# EasyEDA Pro project ProPrj_piezoAmpBoard_2024-09-30.epro

# Schematic Schematic1
Board Name: Board1; Create Date: 2024-03-08; Page Name: P1; Project Name: piezoAmpBoard; Schematic Name: Schematic1; Update Date: 2024-03-09; Company: 嘉立创EDA; Page Size: A4; Version: V1.0
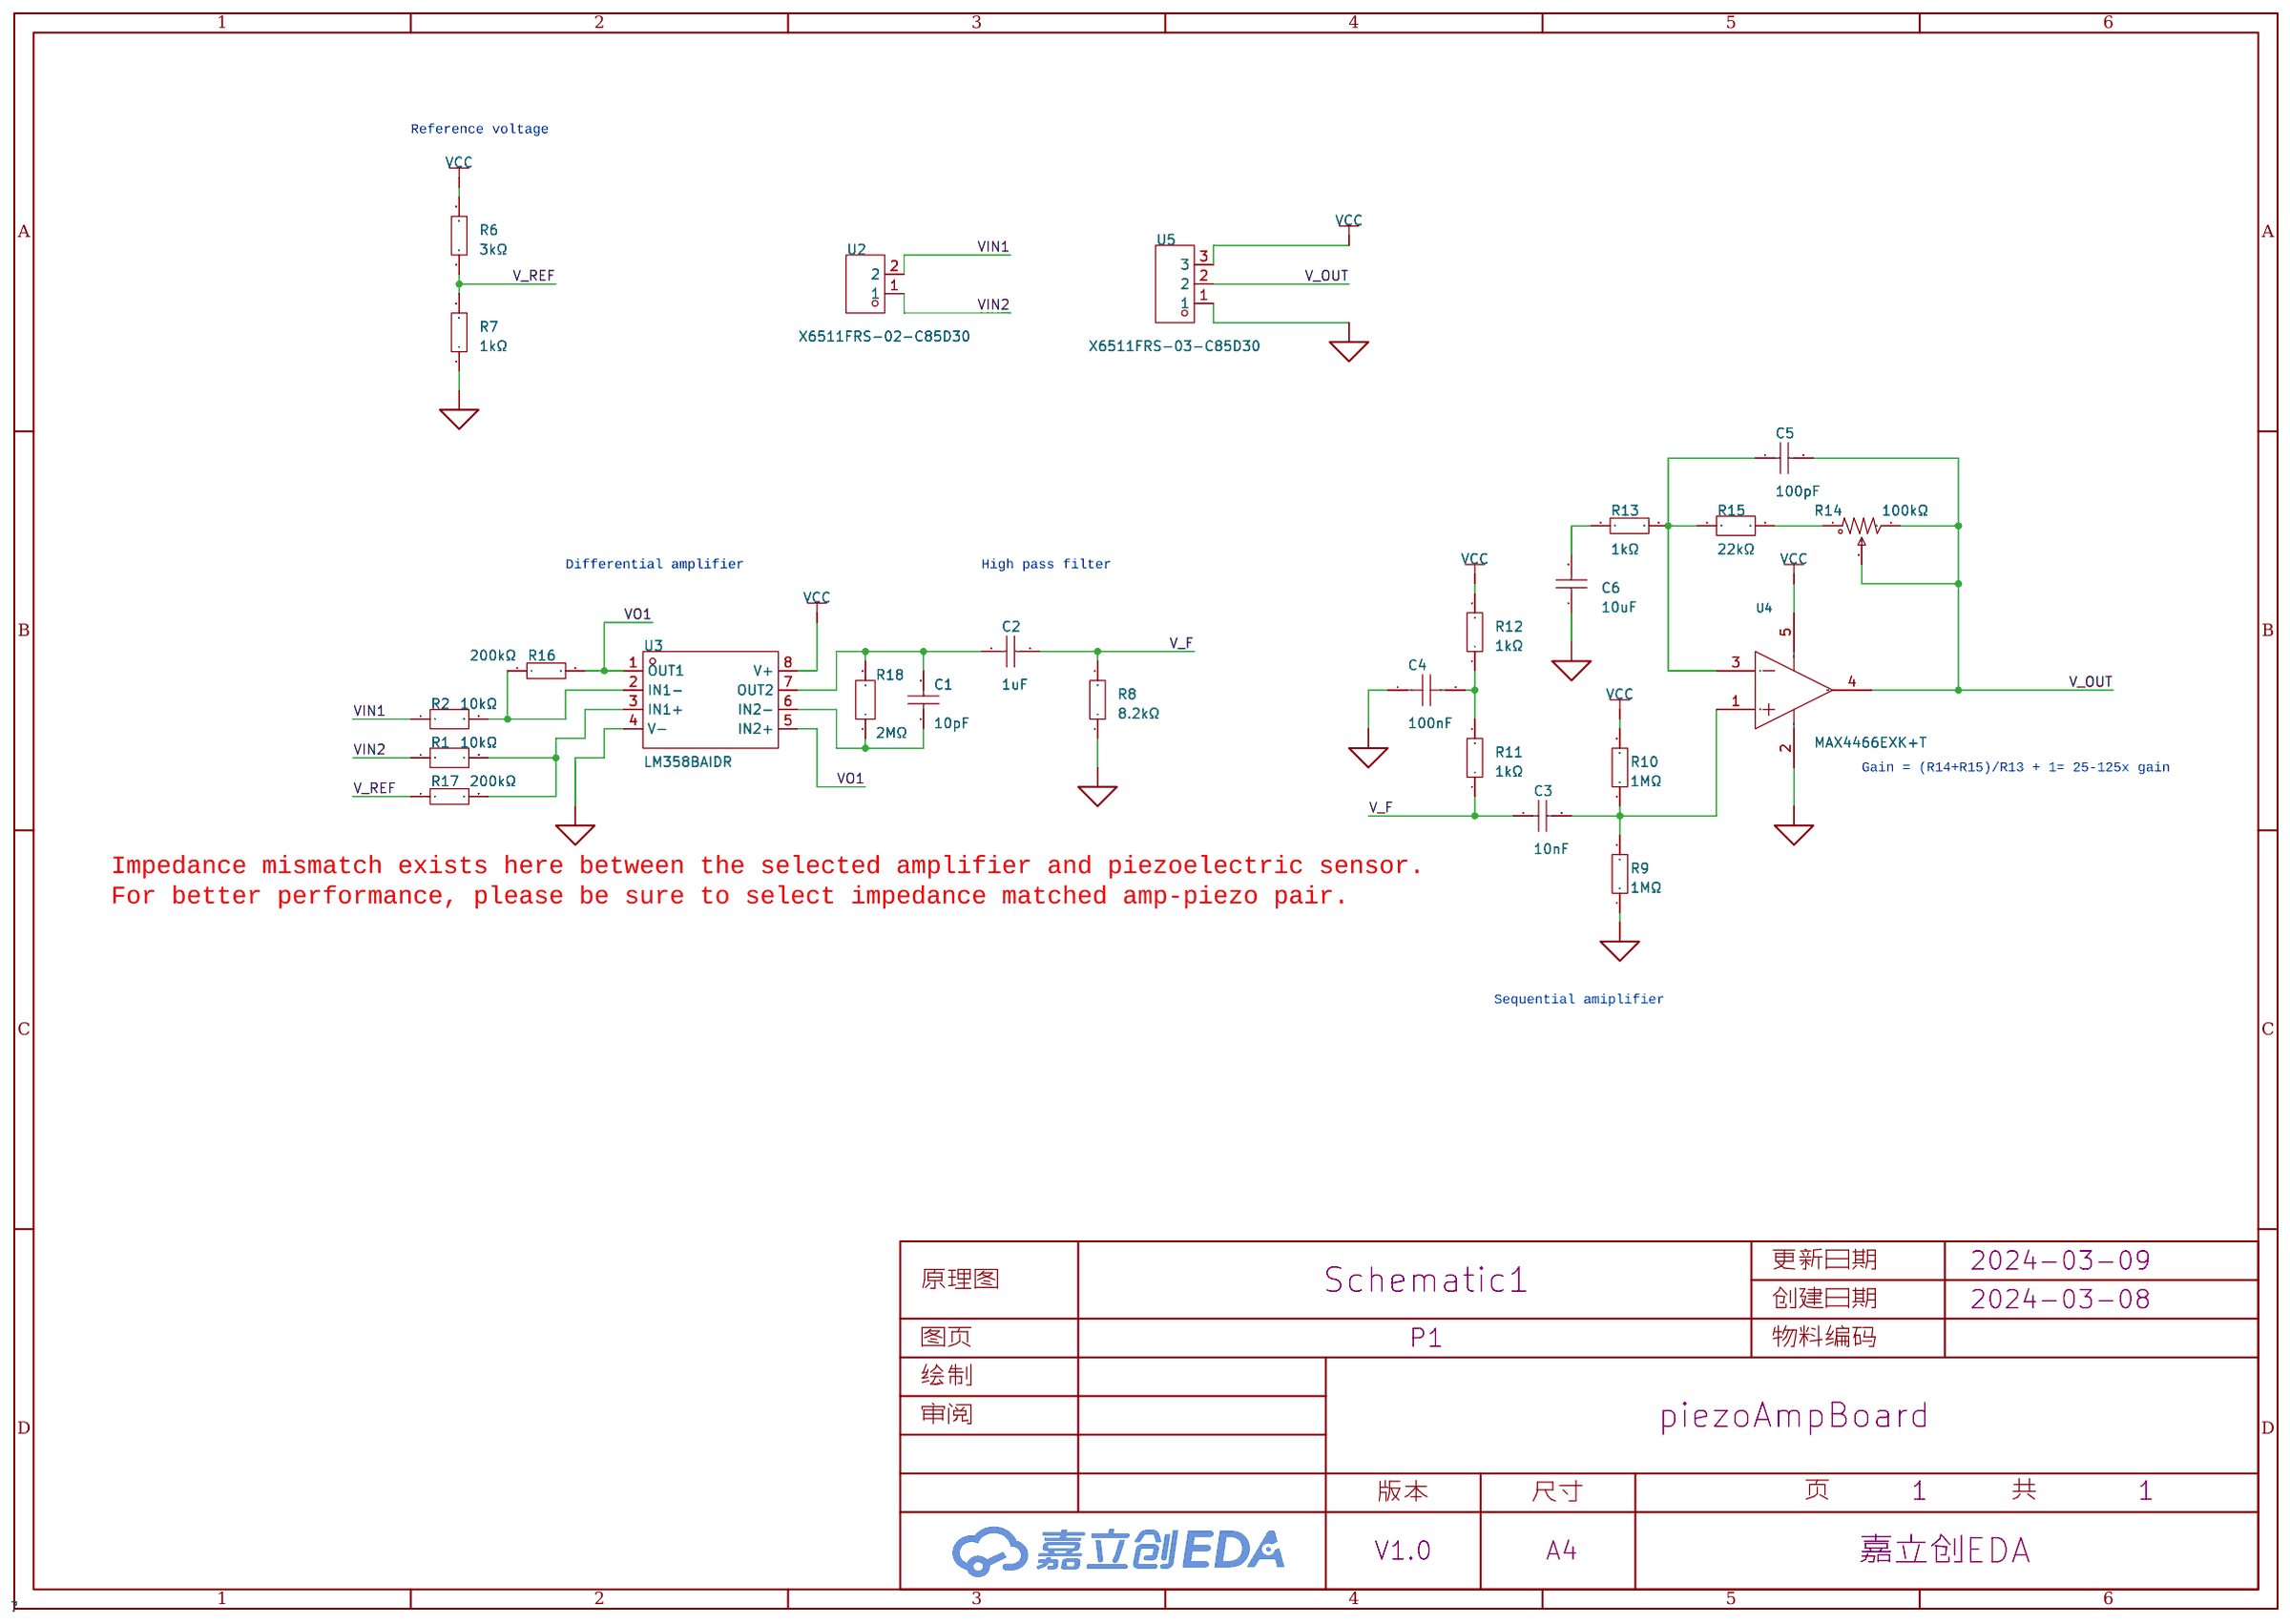
[diagram p0: schematic sheet]

## Parts
C1  10pF  [C0402]
C2  1uF  [C0402]
C3  10nF  [C0402]
C4  100nF  [C0402]
C5  100pF  [C0402]
C6  10uF  [C0402]
R1  10kΩ  [R0201]
R2  10kΩ  [R0201]
R6  3kΩ  [R0402]
R7  1kΩ  [R0402]
R8  8.2kΩ  [R0402]
R9  1MΩ  [R0201]
R10  1MΩ  [R0201]
R11  1kΩ  [R0201]
R12  1kΩ  [R0201]
R13  1kΩ  [R0201]
R14  100kΩ  [RES-ADJ-SMD_TC33X-2-104E]
R15  22kΩ  [R0201]
R16  200kΩ  [R0201]
R17  200kΩ  [R0201]
R18  2MΩ  [R0201]
U2  X6511FRS-02-C85D30  [HDR-SMD_2P-P2.54-H-F-L11.5]
U3  LM358BAIDR  [SOIC-8_L4.9-W3.9-P1.27-LS6.0-BL]
U4  MAX4466EXK+T  [SC-70-5_L2.0-W1.3-P0.65-LS2.1-BR]
U5  X6511FRS-03-C85D30  [HDR-SMD_3P-P2.54-H-F-L11.5]

## Library data of the parts
C1 = CC0402JRNPO9BN100: 容值:10pF;精度:±5%;额定电压:50V;材质(温度系数):NP0;; LCSC Part Name: 10pF ±5% 50V; Supplier Part: C106199; Manufacturer: YAGEO(国巨); Supplier Footprint: 0402; JLCPCB Part Class: 扩展库; Datasheet: https://atta.szlcsc.com/upload/public/pdf/source/20181008/C309499_21CC21451B82C39E3D92150FD6B30293.pdf; Supplier: LCSC; Tolerance: ±5%; Voltage Rated: 50V; Temperature Coefficient: NP0
C2 = CL05A105KP5NNNC: 容值:1uF;精度:±10%;额定电压:10V;材质(温度系数):X5R;; LCSC Part Name: 1uF ±10% 10V; Supplier Part: C14445; Manufacturer: SAMSUNG(三星); Supplier Footprint: 0402; JLCPCB Part Class: 扩展库; Datasheet: https://atta.szlcsc.com/upload/public/pdf/source/20160218/1457707763339.pdf; Supplier: LCSC; Tolerance: ±10%; Voltage Rated: 10V; Temperature Coefficient: X5R
C3 = CC0402KRX7R9BB103: 容值:10nF;精度:±10%;额定电压:50V;材质(温度系数):X7R;; LCSC Part Name: 10nF ±10% 50V; Supplier Part: C60133; Manufacturer: YAGEO(国巨); Supplier Footprint: 0402; JLCPCB Part Class: 扩展库; Datasheet: https://atta.szlcsc.com/upload/public/pdf/source/20180224/C181747_15194369449651363981.pdf; Supplier: LCSC; Tolerance: ±10%; Voltage Rated: 50V; Temperature Coefficient: X7R
C4 = CC0402KRX7R7BB104: 容值:100nF;精度:±10%;额定电压:16V;材质(温度系数):X7R;; LCSC Part Name: 100nF ±10% 16V; Supplier Part: C60474; Manufacturer: YAGEO(国巨); Supplier Footprint: 0402; JLCPCB Part Class: 扩展库; Datasheet: https://atta.szlcsc.com/upload/public/pdf/source/20211223/9278FD768280B81DDBEF48FA36411A03.pdf; Supplier: LCSC; Tolerance: ±10%; Voltage Rated: 16V; Temperature Coefficient: X7R
C5 = GRM1555C1H101JA01D: 容值:100pF;精度:±5%;额定电压:50V;材质(温度系数):C0G;; LCSC Part Name: 100pF ±5% 50V; Supplier Part: C77177; Manufacturer: muRata(村田); Supplier Footprint: 0402; JLCPCB Part Class: 扩展库; Datasheet: https://atta.szlcsc.com/upload/public/pdf/source/20161108/1478586482814.pdf; Supplier: LCSC; Tolerance: ±5%; Voltage Rated: 50V; Temperature Coefficient: C0G
C6 = GRM155R60J106ME44D: 容值:10uF;精度:±20%;额定电压:6.3V;材质(温度系数):X5R;; LCSC Part Name: 10uF ±20% 6.3V; Supplier Part: C76991; Manufacturer: muRata(村田); Supplier Footprint: 0402; JLCPCB Part Class: 扩展库; Datasheet: https://atta.szlcsc.com/upload/public/pdf/source/20200305/C490387_23319AE8C154DEB24C505E6C82A8106A.pdf; Supplier: LCSC; Tolerance: ±20%; Voltage Rated: 6.3V; Temperature Coefficient: X5R
R1 R2 = 0201WMF1002TEE: 电阻类型:厚膜电阻;阻值:10kΩ;精度:±1%;功率:50mW;最大工作电压:25V;温度系数:±200ppm/℃;; LCSC Part Name: 10kΩ ±1% 50mW 厚膜电阻; Supplier Part: C473048; Manufacturer: UNI-ROYAL(厚声); Supplier Footprint: 0201; JLCPCB Part Class: 扩展库; Datasheet: https://atta.szlcsc.com/upload/public/pdf/source/20200306/C422600_1E6D84923E4A46A82E41ADD87F860B5C.pdf; Supplier: LCSC; Type: 厚膜电阻; Tolerance: ±1%; Power(Watts): 50mW; Overload Voltage (Max): 25V; Temperature Coefficient: ±200ppm/℃; Operating Temperature Range: -55℃~+155℃
R6 = 0402WGF3001TCE: 电阻类型:厚膜电阻;阻值:3kΩ;精度:±1%;功率:62.5mW;最大工作电压:50V;温度系数:±100ppm/℃;; LCSC Part Name: 3kΩ ±1% 62.5mW 厚膜电阻; Supplier Part: C25784; Manufacturer: UNI-ROYAL(厚声); Supplier Footprint: 0402; JLCPCB Part Class: 扩展库; Datasheet: https://atta.szlcsc.com/upload/public/pdf/source/20200306/C422600_1E6D84923E4A46A82E41ADD87F860B5C.pdf; Supplier: LCSC; Type: 厚膜电阻; Tolerance: ±1%; Power(Watts): 62.5mW; Overload Voltage (Max): 50V; Temperature Coefficient: ±100ppm/℃; Operating Temperature Range: -55℃~+155℃
R7 = 0402WGF1001TCE: 电阻类型:厚膜电阻;阻值:1kΩ;精度:±1%;功率:62.5mW;最大工作电压:50V;温度系数:±100ppm/℃;; LCSC Part Name: 1kΩ ±1% 62.5mW 厚膜电阻; Supplier Part: C11702; Manufacturer: UNI-ROYAL(厚声); Supplier Footprint: 0402; JLCPCB Part Class: 基础库; Datasheet: https://atta.szlcsc.com/upload/public/pdf/source/20200306/C422600_1E6D84923E4A46A82E41ADD87F860B5C.pdf; Supplier: LCSC; Type: 厚膜电阻; Tolerance: ±1%; Power(Watts): 62.5mW; Overload Voltage (Max): 50V; Temperature Coefficient: ±100ppm/℃; Operating Temperature Range: -55℃~+155℃
R8 = 0402WGF8201TCE: 电阻类型:厚膜电阻;阻值:8.2kΩ;精度:±1%;功率:62.5mW;最大工作电压:50V;温度系数:±100ppm/℃;; LCSC Part Name: 8.2kΩ ±1% 62.5mW 厚膜电阻; Supplier Part: C25924; Manufacturer: UNI-ROYAL(厚声); Supplier Footprint: 0402; JLCPCB Part Class: 扩展库; Datasheet: https://atta.szlcsc.com/upload/public/pdf/source/20200306/C422600_1E6D84923E4A46A82E41ADD87F860B5C.pdf; Supplier: LCSC; Type: 厚膜电阻; Tolerance: ±1%; Power(Watts): 62.5mW; Overload Voltage (Max): 50V; Temperature Coefficient: ±100ppm/℃; Operating Temperature Range: -55℃~+155℃
R9 R10 = RC0201FR-071ML: 电阻类型:厚膜电阻;阻值:1MΩ;精度:±1%;功率:50mW;最大工作电压:25V;温度系数:±200ppm/℃;; LCSC Part Name: 厚膜电阻 1MΩ ±1% 50mW; Supplier Part: C295786; Manufacturer: YAGEO(国巨); Supplier Footprint: 0201; JLCPCB Part Class: 扩展库; Datasheet: https://atta.szlcsc.com/upload/public/pdf/source/20181009/C309620_DA5935B6E1D48212CB7A533FE518B3C2.pdf; Supplier: LCSC; Type: 厚膜电阻; Tolerance: ±1%; Power(Watts): 50mW; Overload Voltage (Max): 25V; Temperature Coefficient: ±200ppm/℃; Operating Temperature Range: -55℃~+125℃
R11-R13 = 0201WMF1001TEE: 电阻类型:厚膜电阻;阻值:1kΩ;精度:±1%;功率:50mW;最大工作电压:25V;温度系数:±200ppm/℃;; LCSC Part Name: 1kΩ ±1% 50mW 厚膜电阻; Supplier Part: C270365; Manufacturer: UNI-ROYAL(厚声); Supplier Footprint: 0201; JLCPCB Part Class: 扩展库; Datasheet: https://atta.szlcsc.com/upload/public/pdf/source/20200306/C422600_1E6D84923E4A46A82E41ADD87F860B5C.pdf; Supplier: LCSC; Type: 厚膜电阻; Tolerance: ±1%; Power(Watts): 50mW; Overload Voltage (Max): 25V; Temperature Coefficient: ±200ppm/℃; Operating Temperature Range: -55℃~+155℃
R14 = TC33X-2-104E: 阻值:100kΩ;精度:±25%;功率:150mW;温度系数:±250ppm/℃;; LCSC Part Name: 100kΩ ±25%; Supplier Part: C719186; Manufacturer: BOURNS; Supplier Footprint: SMD; JLCPCB Part Class: 扩展库; Datasheet: https://atta.szlcsc.com/upload/public/pdf/source/20200810/C720646_BB66A75E654D5E1D30127FF45BCD3C26.pdf; Supplier: LCSC; Tolerance: ±25%; Power(Watts): 150mW; Temperature Coefficient: ±250ppm/℃; Turns: 1
R15 = RC0201FR-0722KL: 电阻类型:厚膜电阻;阻值:22kΩ;精度:±1%;功率:50mW;最大工作电压:25V;温度系数:±200ppm/℃;; LCSC Part Name: 厚膜电阻 22kΩ ±1% 50mW; Supplier Part: C474416; Manufacturer: YAGEO(国巨); Supplier Footprint: 0201; JLCPCB Part Class: 扩展库; Datasheet: https://atta.szlcsc.com/upload/public/pdf/source/20181031/C326976_E9901E35333D136A19B6CE377E889A82.pdf; Supplier: LCSC; Type: 厚膜电阻; Tolerance: ±1%; Power(Watts): 50mW; Overload Voltage (Max): 25V; Temperature Coefficient: ±200ppm/℃; Operating Temperature Range: -55℃~+125℃
R16 R17 = RC0201FR-07200KL: 电阻类型:厚膜电阻;阻值:200kΩ;精度:±1%;功率:50mW;最大工作电压:25V;温度系数:±200ppm/℃;; LCSC Part Name: 厚膜电阻 200kΩ ±1% 50mW; Supplier Part: C138163; Manufacturer: YAGEO(国巨); Supplier Footprint: 0201; JLCPCB Part Class: 扩展库; Datasheet: https://atta.szlcsc.com/upload/public/pdf/source/20181009/C309620_DA5935B6E1D48212CB7A533FE518B3C2.pdf; Supplier: LCSC; Type: 厚膜电阻; Tolerance: ±1%; Power(Watts): 50mW; Overload Voltage (Max): 25V; Temperature Coefficient: ±200ppm/℃; Operating Temperature Range: -55℃~+125℃
R18 = 0201WMF2004TEE: 电阻类型:厚膜电阻;阻值:2MΩ;精度:±1%;功率:50mW;最大工作电压:25V;温度系数:±200ppm/℃;; LCSC Part Name: 2MΩ ±1% 50mW 厚膜电阻; Supplier Part: C473556; Manufacturer: UNI-ROYAL(厚声); Supplier Footprint: 0201; JLCPCB Part Class: 扩展库; Datasheet: https://atta.szlcsc.com/upload/public/pdf/source/20200306/C422600_1E6D84923E4A46A82E41ADD87F860B5C.pdf; Supplier: LCSC; Type: 厚膜电阻; Tolerance: ±1%; Power(Watts): 50mW; Overload Voltage (Max): 25V; Temperature Coefficient: ±200ppm/℃; Operating Temperature Range: -55℃~+155℃
U2 = X6511FRS-02-C85D30: 插孔结构:1x2P;间距:2.54mm;安装类型:卧贴;排数:单排;总孔位数:2P;塑高:8.5mm;; LCSC Part Name: 间距:2.54mm 1x2P 卧贴; Supplier Part: C5142235; Manufacturer: XKB Connectivity(中国星坤); Supplier Footprint: SMD,P=2.54mm,卧贴; JLCPCB Part Class: 扩展库; Datasheet: https://atta.szlcsc.com/upload/public/pdf/source/20220822/AB9A82E80C220285963E5EFA3BFD32FF.pdf; Supplier: LCSC; Holes Structure: 1x2P; Pitch: 2.54mm; Mounting Type: 卧贴; Number of Rows: 单排; Number of Holes: 2P; Insulation Height: 8.5mm
U3 = LM358BAIDR: 放大器数:双路;增益带宽积(GBP):1.2MHz;输入偏置电流(Ib):10nA;压摆率(SR):0.5V/us;带宽(-3db):-;; LCSC Part Name: 行业标准双路运算放大器; Supplier Part: C1849421; Manufacturer: TI(德州仪器); Supplier Footprint: SOIC-8; JLCPCB Part Class: 扩展库; Datasheet: https://www.ti.com/cn/lit/gpn/lm358ba; Supplier: LCSC; Number of Circuits: 双路; Gain Bandwidth Product(GBP): 1.2MHz; Current - Input Bias(Ib): 10nA; Slew Rate(SR): 0.5V/us; Output Current: 40mA; Operating Temperature: -40℃~+125℃
U4 = MAX4466EXK+T: 功放类型:-;扬声器通道数:单声道;输出功率:-;静态电流(Iq):-;; Supplier Part: C7456762; Manufacturer: ADI(亚德诺)/MAXIM(美信); Supplier Footprint: SC-70-5; JLCPCB Part Class: 扩展库; Datasheet: https://atta.szlcsc.com/upload/public/pdf/source/20230919/1C26F795883D5A758FE0EDB1A75C39BE.pdf; Supplier: LCSC; Speaker Channels: 单声道; Supply Voltage: 2.4V~5.5V; Operating Temperature: -40℃~+85℃
U5 = X6511FRS-03-C85D30: 插孔结构:1x3P;间距:2.54mm;安装类型:卧贴;排数:单排;总孔位数:3P;塑高:8.5mm;; LCSC Part Name: 间距:2.54mm 1x3P 卧贴; Supplier Part: C5142236; Manufacturer: XKB Connectivity(中国星坤); Supplier Footprint: SMD,P=2.54mm,卧贴; JLCPCB Part Class: 扩展库; Datasheet: https://atta.szlcsc.com/upload/public/pdf/source/20220822/AB9A82E80C220285963E5EFA3BFD32FF.pdf; Supplier: LCSC; Holes Structure: 1x3P; Pitch: 2.54mm; Mounting Type: 卧贴; Number of Rows: 单排; Number of Holes: 3P; Insulation Height: 8.5mm

## Nets
AGND: C4.1 C6.1 R7.1 R8.1 R9.1 U3.4(V-) U4.2(GND) U5.1
VCC: R6.2 R10.2 R12.2 U3.8(V+) U4.5(VCC) U5.3
VIN1: R2.1 U2.2
VIN2: R1.1 U2.1
V_F: C2.2 C3.1 R8.2 R11.1
V_OUT: C5.2 R14.2 R14.3 U4.4(OUT) U5.2
V_REF: R6.1 R7.2 R17.1
VO1: R16.2 U3.1(OUT1) U3.5(IN2+)
$1N688: R1.2 R17.2 U3.3(IN1+)
$1N766: R2.2 R16.1 U3.2(IN1-)
$1N988: C1.1 R18.1 U3.6(IN2-)
$1N2751: C4.2 R11.2 R12.1
$1N2818: C3.2 R9.2 R10.1 U4.1(IN+)
$1N3169: C6.2 R13.1
$1N3329: C5.1 R13.2 R15.1 U4.3(IN-)
$1N3336: R14.1 R15.2
$1N3656: C1.2 C2.1 R18.2 U3.7(OUT2)

## Notes on the sheet
- Reference voltage
- Differential amplifier
- High pass filter
- Gain = (R14+R15)/R13 + 1= 25-125x gain
- Impedance mismatch exists here between the selected amplifier and piezoelectric sensor.
  For better performance, please be sure to select impedance matched amp-piezo pair.
- Sequential amiplifier

# Board PCB1
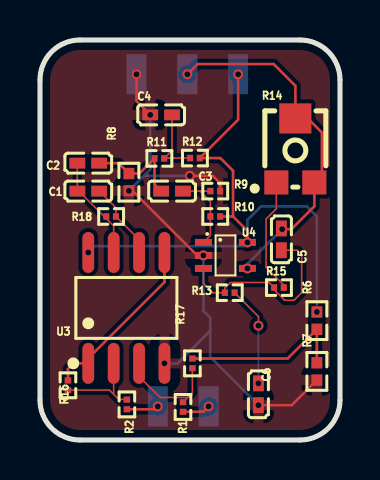
[diagram p1: board, top side]
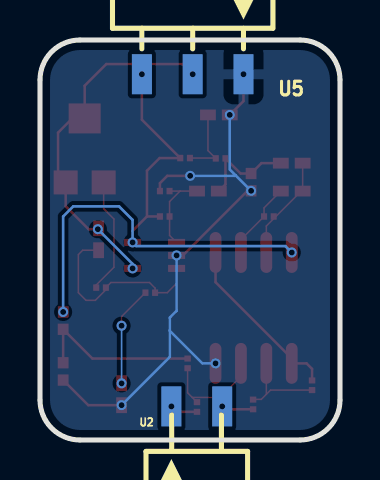
[diagram p2: board, bottom side, seen from below]

Outline 15 x 20 mm; copper layers: Top Layer, Bottom Layer. Coordinates in mm from the lower left corner of the outline.
Outline path: 0,18 0,2 arc(0.59,0.59) 2,0 13,0 arc(14.41,0.59) 15,2 15,18 arc(14.41,19.41) 13,20 2,20 arc(0.59,19.41) 0,18
Stack: Top Layer 0.035mm / Dielectric1 1.51mm FR4 er 4.5 / Bottom Layer 0.035mm

## Design rules (mm)
template: 自定义配置
spacing copperThickness1oz (default): track to track 0.102, other pairs 0.152 to 0.3
spacing copperThickness2oz: track to track 0.203, other pairs 0.152 to 0.3
track width copperThickness1oz (default): min 0.076, default 0.102, max 0.102
track width copperThickness2oz: min 0.127, default 0.152, max 0.152
differential pair differentialPair (default): width min 0.127, default 0.254, max 2.54; gap min 0.152, default 0.152
via viaSize (default): diameter min 0.5, default 0.5, max 10; hole min 0.3, default 0.3, max 6.299
net VO1 uses copperThickness2oz
net AGND uses copperThickness2oz
net VCC uses copperThickness2oz
net VIN2 uses copperThickness2oz
net VIN1 uses copperThickness2oz
net V_REF uses copperThickness2oz
net V_F uses copperThickness2oz
net V_OUT uses copperThickness2oz

## Placement (name value [footprint] x y rotation side)
C1  10pF  [C0402]  2.41 12.45 180 top
C2  1uF  [C0402]  2.41 13.84 0 top
C3  10nF  [C0402]  6.6 12.45 0 top
C4  100nF  [C0402]  6.06 16.26 0 top
C5  100pF  [C0402]  12.07 10.03 90 top
C6  10uF  [C0402]  10.92 2.29 90 top
R1  10kΩ  [R0201]  7.15 1.65 90 top
R2  10kΩ  [R0201]  4.35 1.78 90 top
R6  3kΩ  [R0402]  13.84 5.97 90 top
R7  1kΩ  [R0402]  13.84 3.43 90 top
R8  8.2kΩ  [R0402]  4.44 12.89 90 top
R9  1MΩ  [R0201]  8.76 12.45 180 top
R10  1MΩ  [R0201]  8.76 11.18 0 top
R11  1kΩ  [R0201]  5.97 14.08 0 top
R12  1kΩ  [R0201]  7.75 14.1 0 top
R13  1kΩ  [R0201]  9.49 7.37 180 top
R14  100kΩ  [RES-ADJ-SMD_TC33X-2-104E]  12.77 14.48 0 top
R15  22kΩ  [R0201]  11.95 7.62 0 top
R16  200kΩ  [R0201]  1.4 2.74 90 top
R17  200kΩ  [R0201]  7.62 3.83 270 top
R18  2MΩ  [R0201]  3.56 11.18 180 top
U2  X6511FRS-02-C85D30  [HDR-SMD_2P-P2.54-H-F-L11.5]  7.16 1.68 180 bottom
U3  LM358BAIDR  [SOIC-8_L4.9-W3.9-P1.27-LS6.0-BL]  4.32 6.6 0 top
U4  MAX4466EXK+T  [SC-70-5_L2.0-W1.3-P0.65-LS2.1-BR]  9.27 9.23 180 top
U5  X6511FRS-03-C85D30  [HDR-SMD_3P-P2.54-H-F-L11.5]  7.37 18.29 0 bottom

## Footprints (pads in the part's own frame, mm; a bottom-side part is the same pattern mirrored in y, then rotated)
C0402
  rect 0.79x0.54 smd: 1(-0.545,0) 2(0.545,0)
HDR-SMD_2P-P2.54-H-F-L11.5
  rect 1x2 smd: 1(-1.27,0) 2(1.27,0)
HDR-SMD_3P-P2.54-H-F-L11.5
  rect 1x2 smd: 1(-2.54,0) 2(0,0) 3(2.54,0)
R0201
  rect 0.303x0.324 smd: 1(-0.241,0) 2(0.241,0)
R0402
  rect 0.566x0.54 smd: 1(-0.433,0) 2(0.433,0)
RES-ADJ-SMD_TC33X-2-104E
  rect 1.2x1.2 smd: 1(-0.95,-1.6) 3(0.95,-1.6)
  rect 1.6x1.5 smd: 2(0,1.6)
SC-70-5_L2.0-W1.3-P0.65-LS2.1-BR
  rect 0.85x0.35 smd: 1(1.1,-0.65) 2(1.1,0) 3(1.1,0.65) 4(-1.1,0.65) 5(-1.1,-0.65)
SOIC-8_L4.9-W3.9-P1.27-LS6.0-BL
  oval 0.588x2.045 smd: 1(-1.905,-2.772) 2(-0.635,-2.772) 3(0.635,-2.772) 4(1.905,-2.772) 5(1.905,2.772) 6(0.635,2.772) 7(-0.635,2.772) 8(-1.905,2.772)

## Nets
As in the schematic.

## Via types
v1: diameter 0.5, hole 0.3, Top Layer to Bottom Layer, 18 vias

## Routing (per net, layer and track width the routed paths; a pad name or vN(x,y) marks a point on that pad's centre or on a via; arc(x,y) is an arc through that point)
AGND: length 31
  Top Layer w0.127: v1(4.44,12.46) 4.62,12.46 7.81,9.27 8.13,9.27 v1(8.17,9.23) ; v1(10.92,1.74) 12.59,1.74 R7.1 ; v1(7.49,13.21) 8.64,13.21 9,12.84 R9.1 ; v1(4.83,18.29) 4.83,16.94 v1(5.51,16.26)
  Bottom Layer w0.127: v1(5.51,16.26) 5.51,13.53 5.23,13.24 ; v1(6.22,3.83) 6.88,3.83 8.51,5.46 ; 5.23,13.24 v1(4.44,12.46) ; 5.23,13.24 5.26,13.21 v1(7.49,13.21) ; 8.51,5.46 8.51,6.12 8.17,6.46 v1(8.17,9.23) ; 8.51,5.46 8.51,4.15 v1(10.92,1.74)
VCC: length 29.5
  Top Layer w0.127: 9.65,11.18 9.65,13.46 9.02,14.1 R12.2 9.91,16.02 v1(9.91,18.29) ; 9.65,11.18 R10.2 ; 9.65,11.18 10.37,10.46 v1(10.37,9.88)
  Bottom Layer w0.127: v1(2.41,9.38) 2.73,9.69 10.19,9.69 v1(10.37,9.88) 10.37,11.01 11.05,11.68 13.34,11.68 13.84,11.18 v1(13.84,6.4)
VIN1: length 1.6
  Top Layer w0.127: v1(5.89,1.68) 5.75,1.54 R2.1
VIN2: length 1.4
  Top Layer w0.127: R1.1 8.16,1.41 v1(8.43,1.68)
V_F: length 5.1
  Top Layer w0.127: C2.2 3.93,13.84 R8.2 4.97,13.32 R11.1 5.73,12.78 C3.1
V_OUT: length 18
  Top Layer w0.127: C5.2 v1(12.11,10.54) 12.57,10.54 13.72,11.69 R14.3 14.1,13.26 14.1,15.37 13.39,16.08 R14.2 12.77,17.71 11.68,18.8 7.87,18.8 v1(7.37,18.29)
  Bottom Layer w0.127: v1(12.11,10.54) 10.37,8.8 v1(10.37,8.58)
V_REF: length 8.5
  Top Layer w0.127: R7.2 R6.1 12.38,4.07 R17.1
VO1: length 8.8
  Top Layer w0.127: U3.5 6.22,7.89 2.41,4.08 U3.1 1.67,3.83 1.4,3.56 R16.2
$1N688: length 5.4
  Top Layer w0.076: R17.2 7.62,2.36 7.39,2.13 ; 7.39,2.13 R1.2 ; 7.39,2.13 6,2.13 4.95,3.17 U3.3
$1N766: length 4.7
  Top Layer w0.076: U3.2 3.68,2.29 ; 3.68,2.29 3.94,2.03 4.33,2.03 R2.2 ; 3.68,2.29 3.47,2.49 R16.1
$1N988: length 3.9
  Top Layer w0.076: U3.6 4.95,10.02 R18.1 3.8,11.61 C1.1
$1N2751: length 3.6
  Top Layer w0.076: 6.23,14.1 6.6,14.47 C4.2 ; 6.23,14.1 R12.1 ; 6.23,14.1 R11.2
$1N2818: length 4.3
  Top Layer w0.076: 8,12.45 R9.2 ; 8,12.45 C3.2 ; 8,12.45 8.52,11.92 R10.1 8.52,10.23 U4.1
$1N3169: length 5
  Top Layer w0.076: R13.1 10.92,6.17 v1(10.92,5.72)
  Bottom Layer w0.076: v1(10.92,2.83) 10.92,5.71
$1N3329: length 9.8
  Top Layer w0.076: C5.1 12.86,9.49 13.08,9.27 13.08,7.37 12.7,6.98 12.23,6.98 11.71,7.51 R15.1 11.45,7.87 9.53,7.87 9.25,7.59 R13.2 8.64,7.37 8.17,7.83 U4.3
$1N3336: length 5.8
  Top Layer w0.076: R15.2 12.19,7.75 11.3,8.64 11.3,11.05 11.82,11.56 R14.1
$1N3656: length 5.3
  Top Layer w0.076: U3.7 3.68,10.7 3.31,11.07 R18.2 3.21,11.18 1.94,12.45 C1.2 C2.1

## Copper pours and planes (outline as drawn; the poured copper is in the pictures)
AGND on Top Layer: -0.13,20.19 15.11,20.19 15.11,-0.13 -0.13,-0.13
AGND on Bottom Layer: -0.13,20.19 15.11,20.19 15.11,-0.13 -0.13,-0.13
